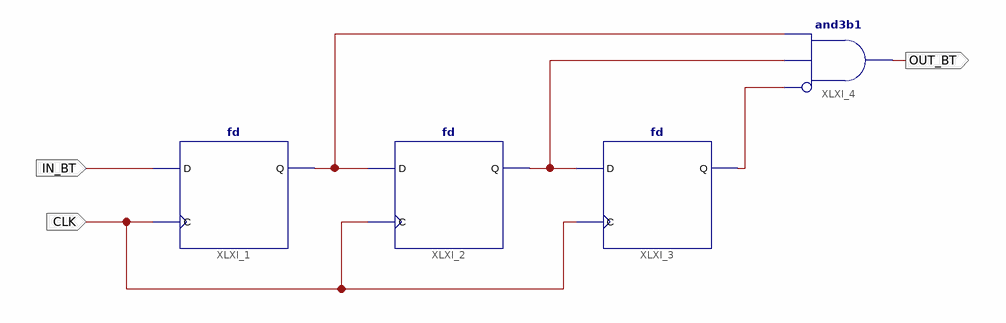
[diagram p0: schematic sheet 1]
// Xilinx ISE schematic Debounce.sch (spartan6) as structural Verilog: 4 symbols, 3 ports
module Debounce (
  input  CLK,
  input  IN_BT,
  output OUT_BT
);

  wire XLXN_4, XLXN_6, XLXN_7;

  fd XLXI_1 (.C(CLK), .D(IN_BT), .Q(XLXN_7));
  fd XLXI_2 (.C(CLK), .D(XLXN_7), .Q(XLXN_6));
  fd XLXI_3 (.C(CLK), .D(XLXN_6), .Q(XLXN_4));
  and XLXI_4 (OUT_BT, ~XLXN_4, XLXN_6, XLXN_7);  // and3b1
endmodule
